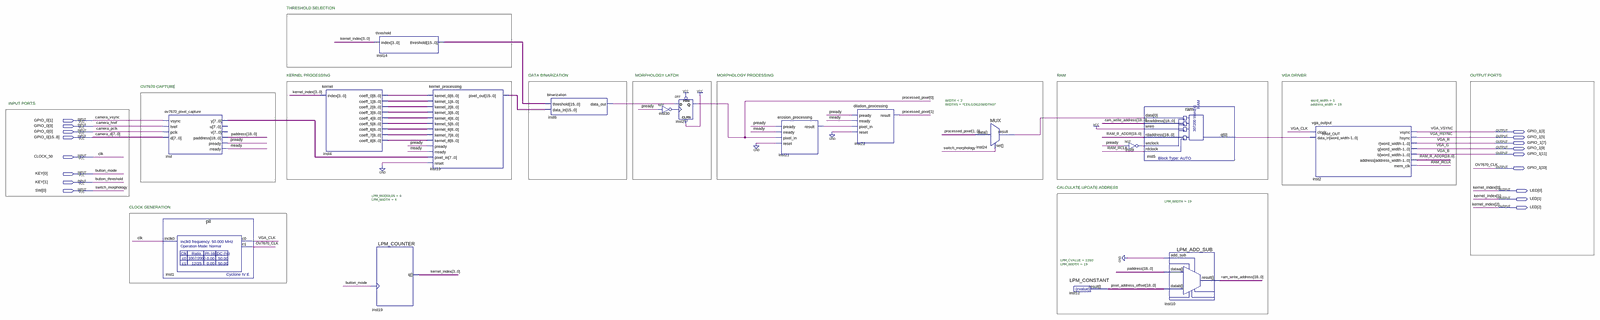
[diagram p0: schematic sheet, whole]
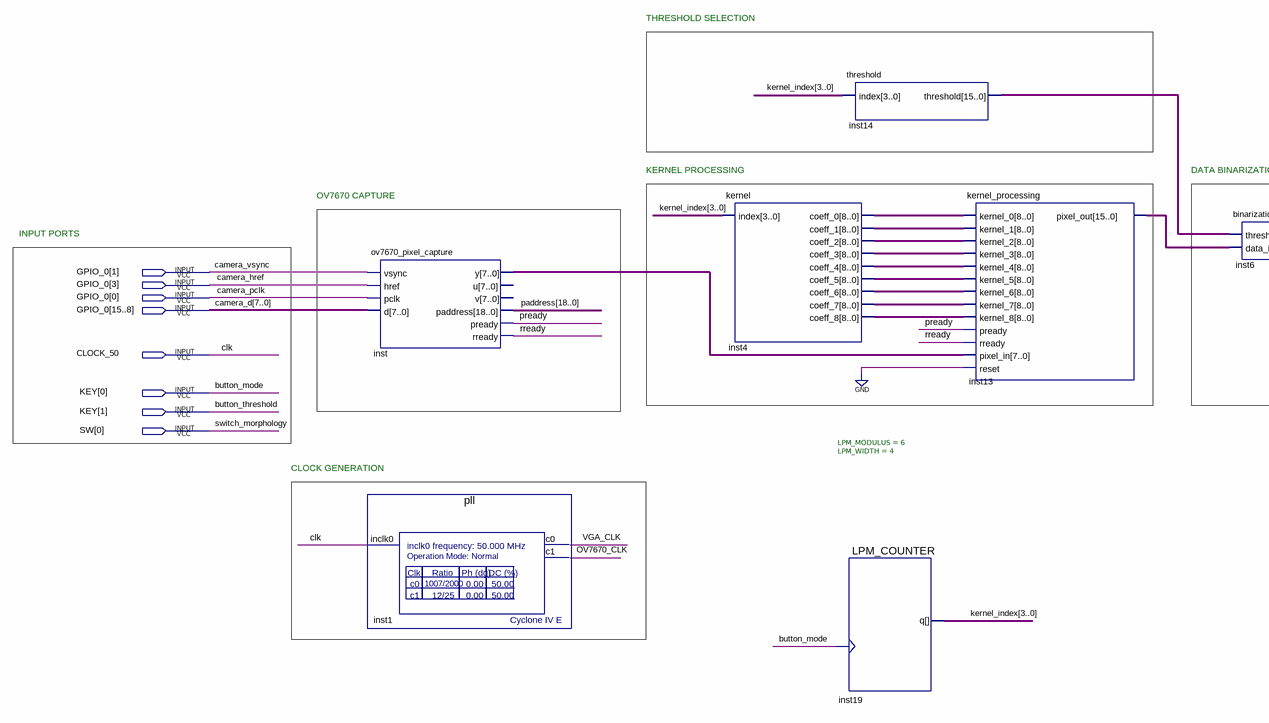
[diagram p1: schematic sheet, left part]
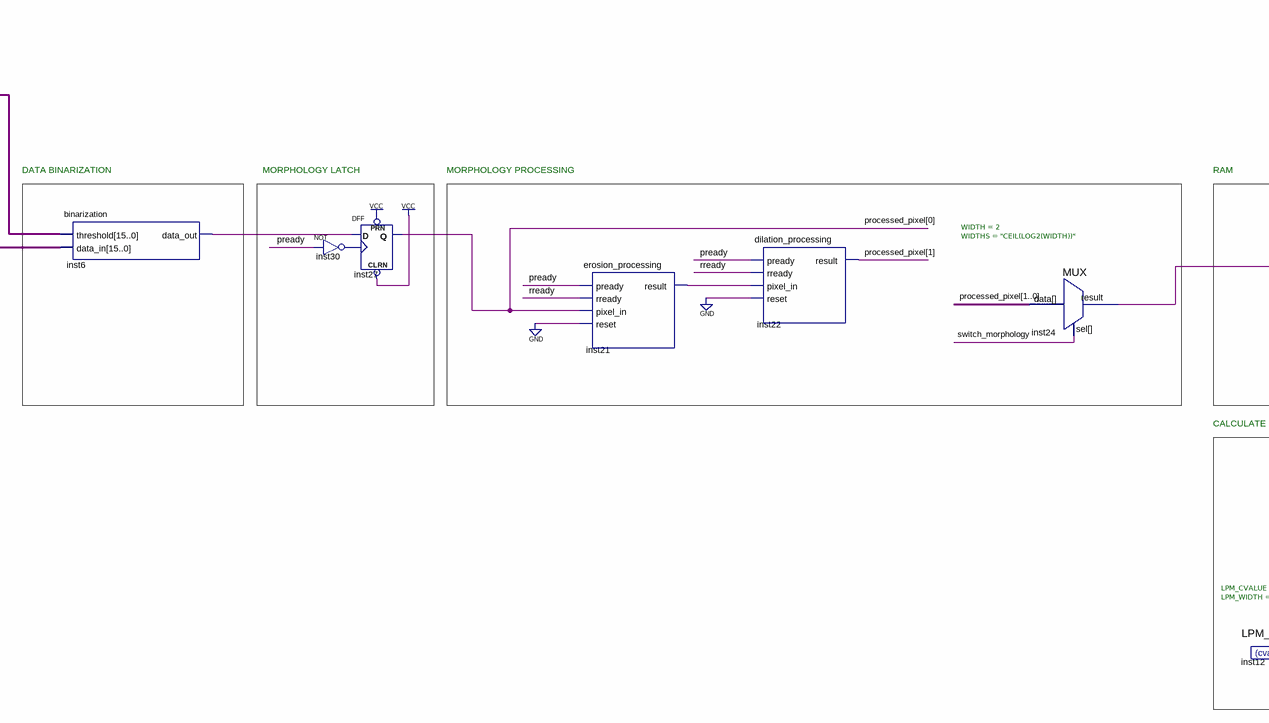
[diagram p2: schematic sheet, centre part]
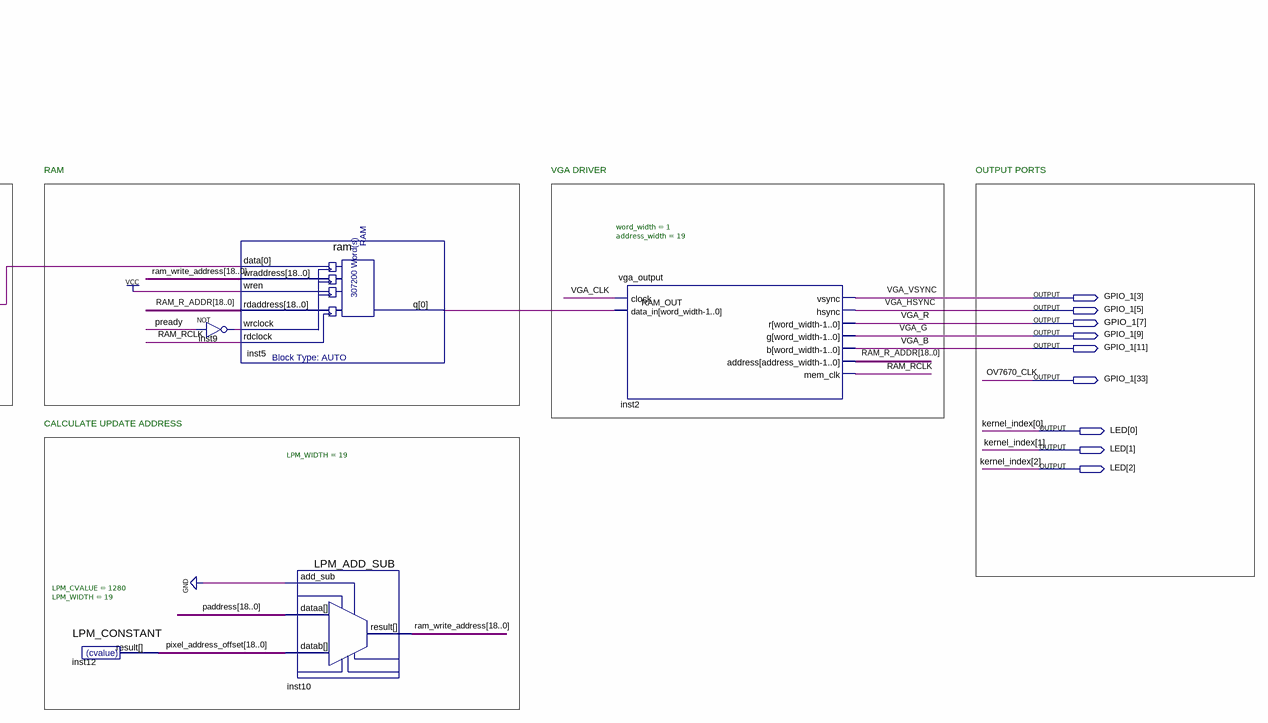
[diagram p3: schematic sheet, right part]
// Quartus schematic cyclops.bdf as structural Verilog: 17 symbols, 17 pins
module cyclops (
  input  [15:0] GPIO_0,
  input  CLOCK_50,
  input  [1:0] KEY,
  input  [0:0] SW,
  output [33:3] GPIO_1,
  output [2:0] LED
);

  wire inst6_data_out, inst9_out, inst21_result, inst24_result, inst30_out, pready, RAM_OUT, RAM_RCLK,
       rready, VGA_CLK;
  wire [1:0] processed_pixel;
  wire [3:3] kernel_index;
  wire [7:0] inst_y;
  wire [8:0] inst4_coeff_0, inst4_coeff_1, inst4_coeff_2, inst4_coeff_3, inst4_coeff_4, inst4_coeff_5,
       inst4_coeff_6, inst4_coeff_7, inst4_coeff_8;
  wire [15:0] inst13_pixel_out, inst14_threshold;
  wire [18:0] paddress, pixel_address_offset, RAM_R_ADDR, ram_write_address;

  ov7670_pixel_capture inst (
    .vsync(GPIO_0[1]), .href(GPIO_0[3]), .pclk(GPIO_0[0]), .d(GPIO_0[15:8]), .y(inst_y), .paddress(paddress),
    .pready(pready), .rready(rready));  // open: u, v
  pll inst1 (.inclk0(CLOCK_50), .c0(VGA_CLK), .c1(GPIO_1[33]));
  kernel inst4 (
    .index({kernel_index[3], LED}), .coeff_0(inst4_coeff_0), .coeff_1(inst4_coeff_1),
    .coeff_2(inst4_coeff_2), .coeff_3(inst4_coeff_3), .coeff_4(inst4_coeff_4), .coeff_5(inst4_coeff_5),
    .coeff_6(inst4_coeff_6), .coeff_7(inst4_coeff_7), .coeff_8(inst4_coeff_8));
  threshold inst14 (.index({kernel_index[3], LED}), .threshold(inst14_threshold));
  LPM_COUNTER #(.LPM_MODULUS(6), .LPM_WIDTH(4)) inst19 (.clock(KEY[0]), .q({kernel_index[3], LED}));
  kernel_processing inst13 (
    .kernel_0(inst4_coeff_0), .kernel_1(inst4_coeff_1), .kernel_2(inst4_coeff_2), .kernel_3(inst4_coeff_3),
    .kernel_4(inst4_coeff_4), .kernel_5(inst4_coeff_5), .kernel_6(inst4_coeff_6), .kernel_7(inst4_coeff_7),
    .kernel_8(inst4_coeff_8), .pready(pready), .rready(rready), .pixel_in(inst_y), .reset(1'b0),
    .pixel_out(inst13_pixel_out));
  binarization inst6 (.threshold(inst14_threshold), .data_in(inst13_pixel_out), .data_out(inst6_data_out));
  DFF inst27 (.CLRN(1'b1), .CLK(inst30_out), .D(inst6_data_out), .PRN(1'b1), .Q(processed_pixel[0]));
  not inst30 (inst30_out, pready);
  erosion_processing inst21 (
    .pready(pready), .rready(rready), .pixel_in(processed_pixel[0]), .reset(1'b0), .result(inst21_result));
  dilation_processing inst22 (
    .pready(pready), .rready(rready), .pixel_in(inst21_result), .reset(1'b0), .result(processed_pixel[1]));
  MUX #(.WIDTH(2), .WIDTHS("CEIL(LOG2(WIDTH))")) inst24 (.data(processed_pixel), .sel(SW[0]), .result(inst24_result));
  LPM_CONSTANT #(.LPM_CVALUE(1280), .LPM_WIDTH(19)) inst12 (.result(pixel_address_offset));
  not inst9 (inst9_out, pready);
  ram inst5 (
    .data(inst24_result), .wraddress(ram_write_address), .wren(1'b1), .rdaddress(RAM_R_ADDR),
    .wrclock(inst9_out), .rdclock(RAM_RCLK), .q(RAM_OUT));
  LPM_ADD_SUB #(.LPM_WIDTH(19)) inst10 (
    .add_sub(1'b0), .dataa(paddress), .datab(pixel_address_offset), .result(ram_write_address));
  vga_output #(.word_width(1), .address_width(19)) inst2 (
    .clock(VGA_CLK), .data_in(RAM_OUT), .vsync(GPIO_1[3]), .hsync(GPIO_1[5]), .r(GPIO_1[7]), .g(GPIO_1[9]),
    .b(GPIO_1[11]), .address(RAM_R_ADDR), .mem_clk(RAM_RCLK));

  // Other names for the same wires on the sheet: button_mode = KEY[0]; button_threshold = KEY[1];
  //   camera_d[7:0] = GPIO_0[15:8]; camera_href = GPIO_0[3]; camera_pclk = GPIO_0[0]; camera_vsync = GPIO_0[1];
  //   clk = CLOCK_50; kernel_index[2:0] = LED; OV7670_CLK = GPIO_1[33]; switch_morphology = SW[0]; VGA_B = GPIO_1[11];
  //   VGA_G = GPIO_1[9]; VGA_HSYNC = GPIO_1[5]; VGA_R = GPIO_1[7]; VGA_VSYNC = GPIO_1[3]

  // Notes on the sheet:
  //   THRESHOLD SELECTION
  //   KERNEL PROCESSING
  //   DATA BINARIZATION
  //   MORPHOLOGY LATCH
  //   MORPHOLOGY PROCESSING
  //   RAM
  //   VGA DRIVER
  //   OUTPUT PORTS
  //   OV7670 CAPTURE
  //   INPUT PORTS
  //   CALCULATE UPDATE ADDRESS
  //   CLOCK GENERATION
endmodule
